# EAGLE schematic LedClock (EAGLE 7.5.0)
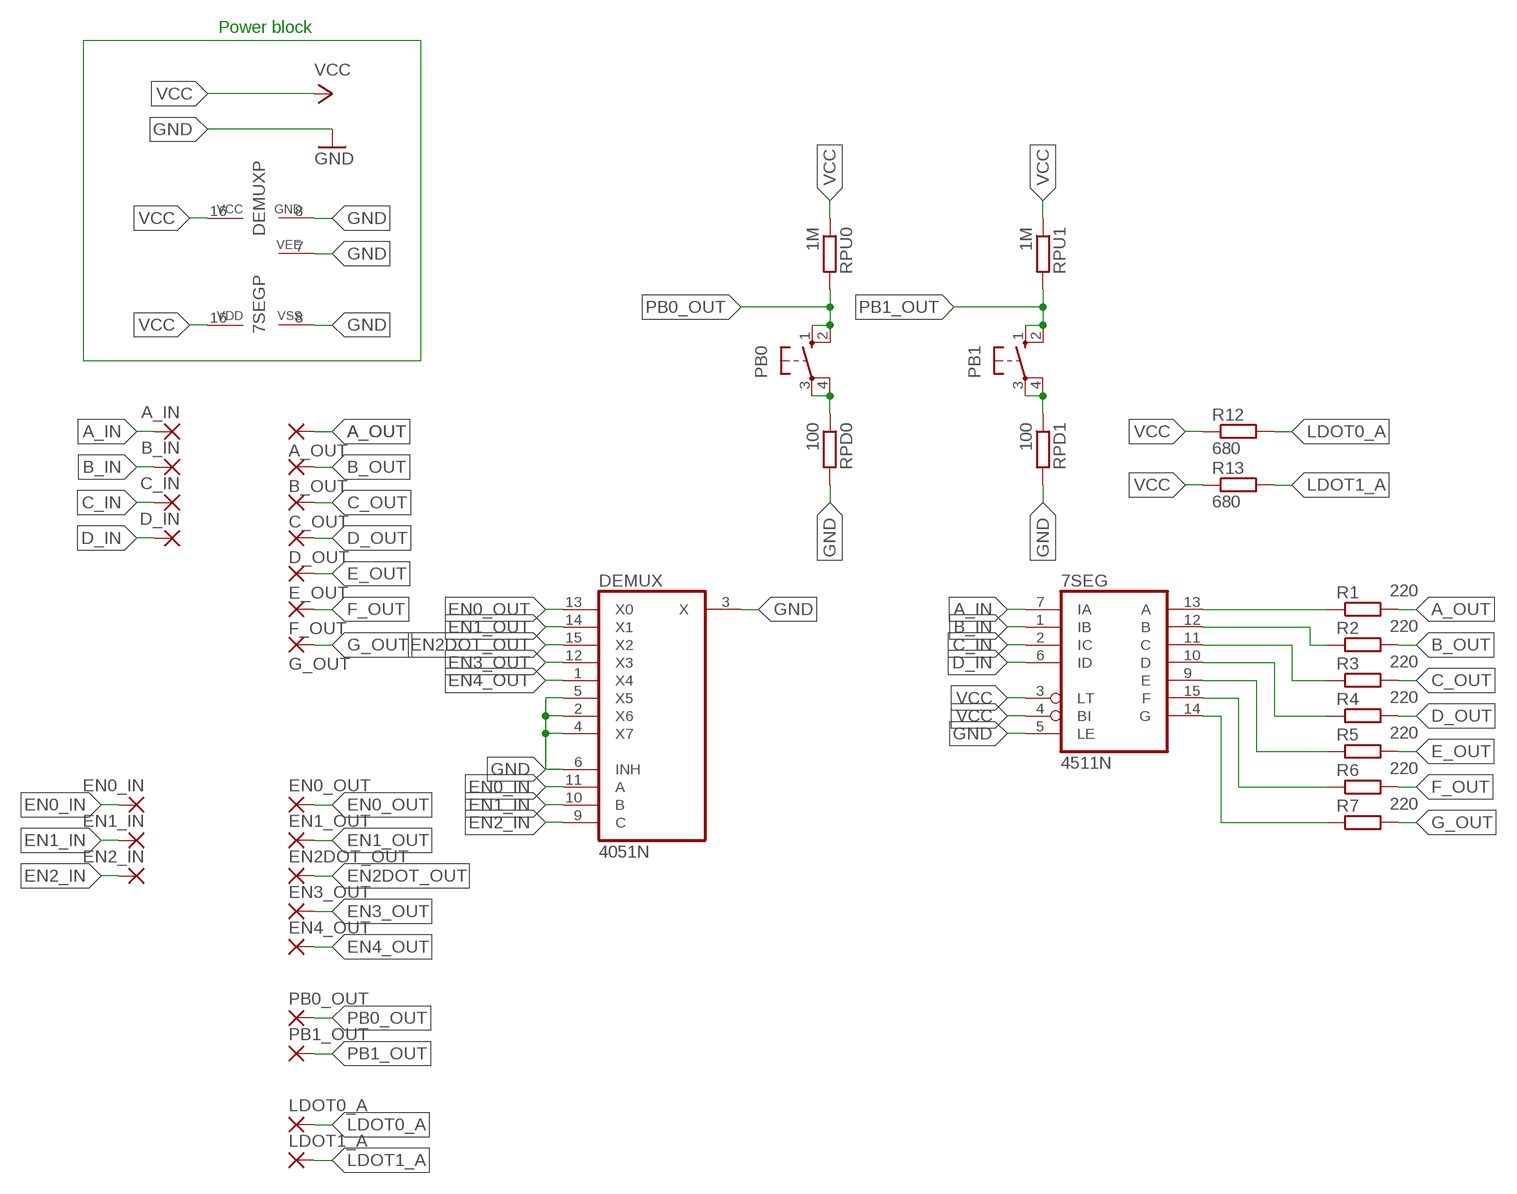
[diagram p0: schematic, sheet 1]

## Parts
7SEG  4511N  [DIL16]
A_IN  2,54/1,0  [2,54/1,0]
A_OUT  2,54/1,0  [2,54/1,0]
B_IN  2,54/1,0  [2,54/1,0]
B_OUT  2,54/1,0  [2,54/1,0]
C_IN  2,54/1,0  [2,54/1,0]
C_OUT  2,54/1,0  [2,54/1,0]
D_IN  2,54/1,0  [2,54/1,0]
D_OUT  2,54/1,0  [2,54/1,0]
DEMUX  4051N  [DIL16]
E_OUT  2,54/1,0  [2,54/1,0]
EN0_IN  2,54/1,0  [2,54/1,0]
EN0_OUT  2,54/1,0  [2,54/1,0]
EN1_IN  2,54/1,0  [2,54/1,0]
EN1_OUT  2,54/1,0  [2,54/1,0]
EN2_IN  2,54/1,0  [2,54/1,0]
EN2DOT_OUT  2,54/1,0  [2,54/1,0]
EN3_OUT  2,54/1,0  [2,54/1,0]
EN4_OUT  2,54/1,0  [2,54/1,0]
F_OUT  2,54/1,0  [2,54/1,0]
G_OUT  2,54/1,0  [2,54/1,0]
LDOT0_A  2,54/1,0  [2,54/1,0]
LDOT1_A  2,54/1,0  [2,54/1,0]
PB0  10-XX  [B3F-10XX]
PB0_OUT  2,54/1,0  [2,54/1,0]
PB1  10-XX  [B3F-10XX]
PB1_OUT  2,54/1,0  [2,54/1,0]
R1  220  R-EU_R1206  [R1206]
R2  220  R-EU_R1206  [R1206]
R3  220  R-EU_R1206  [R1206]
R4  220  R-EU_R1206  [R1206]
R5  220  R-EU_R1206  [R1206]
R6  220  R-EU_R1206  [R1206]
R7  220  R-EU_R1206  [R1206]
R12  680  R-EU_R1206  [R1206]
R13  680  R-EU_R1206  [R1206]
RPD0  100  R-EU_R1206  [R1206]
RPD1  100  R-EU_R1206  [R1206]
RPU0  1M  R-EU_R1206  [R1206]
RPU1  1M  R-EU_R1206  [R1206]

## Nets
A_IN: 7SEG.7(IA) A_IN.1(P)
A_OUT: A_OUT.1(P) R1.2
B_IN: 7SEG.1(IB) B_IN.1(P)
B_OUT: B_OUT.1(P) R2.2
C_IN: 7SEG.2(IC) C_IN.1(P)
C_OUT: C_OUT.1(P) R3.2
D_IN: 7SEG.6(ID) D_IN.1(P)
D_OUT: D_OUT.1(P) R4.2
E_OUT: E_OUT.1(P) R5.2
EN0_IN: DEMUX.11(A) EN0_IN.1(P)
EN0_OUT: DEMUX.13(X0) EN0_OUT.1(P)
EN1_IN: DEMUX.10(B) EN1_IN.1(P)
EN1_OUT: DEMUX.14(X1) EN1_OUT.1(P)
EN2_IN: DEMUX.9(C) EN2_IN.1(P)
EN2DOT_OUT: DEMUX.15(X2) EN2DOT_OUT.1(P)
EN3_OUT: DEMUX.12(X3) EN3_OUT.1(P)
EN4_OUT: DEMUX.1(X4) EN4_OUT.1(P)
F_OUT: F_OUT.1(P) R6.2
G_OUT: G_OUT.1(P) R7.2
GND: 7SEG.5(LE) 7SEG.8(VSS) DEMUX.2(X6) DEMUX.3(X) DEMUX.4(X7) DEMUX.5(X5) DEMUX.6(INH) DEMUX.7(VEE) DEMUX.8(GND) RPD0.2 RPD1.2
LDOT0_A: LDOT0_A.1(P) R12.2
LDOT1_A: LDOT1_A.1(P) R13.2
N$1: 7SEG.13(A) R1.1
N$2: 7SEG.12(B) R2.1
N$3: 7SEG.11(C) R3.1
N$4: 7SEG.10(D) R4.1
N$5: 7SEG.9(E) R5.1
N$6: 7SEG.15(F) R6.1
N$7: 7SEG.14(G) R7.1
N$8: PB0.3(P) PB0.4(P1) RPD0.1
N$9: PB1.3(P) PB1.4(P1) RPD1.1
PB0_OUT: PB0.1(S) PB0.2(S1) PB0_OUT.1(P) RPU0.2
PB1_OUT: PB1.1(S) PB1.2(S1) PB1_OUT.1(P) RPU1.2
VCC: 7SEG.3(LT) 7SEG.4(BI) 7SEG.16(VDD) DEMUX.16(VCC) R12.1 R13.1 RPU0.1 RPU1.1

## Notes on the sheet
- Power block

## Library data of the parts
7SEG = 45xx:4511: BCD to 7-segment LATCH/DECODER/DRIVER
A_IN A_OUT B_IN B_OUT C_IN C_OUT D_IN D_OUT E_OUT EN0_IN EN0_OUT EN1_IN EN1_OUT EN2_IN EN2DOT_OUT EN3_OUT EN4_OUT F_OUT G_OUT LDOT0_A LDOT1_A PB0_OUT PB1_OUT = wirepad:2,54/1,0: THROUGH-HOLE PAD
DEMUX = 40xx:4051: 8-channel ANALOG MULTIPLEXER
PB0 PB1 = switch-omron:10-XX: OMRON SWITCH; MPN: B3F-1000; OC_FARNELL: 176432; OC_NEWARK: 36M3542
R1-R7 R12 R13 RPD0 RPD1 RPU0 RPU1 = rcl:R-EU_: RESISTOR, European symbol